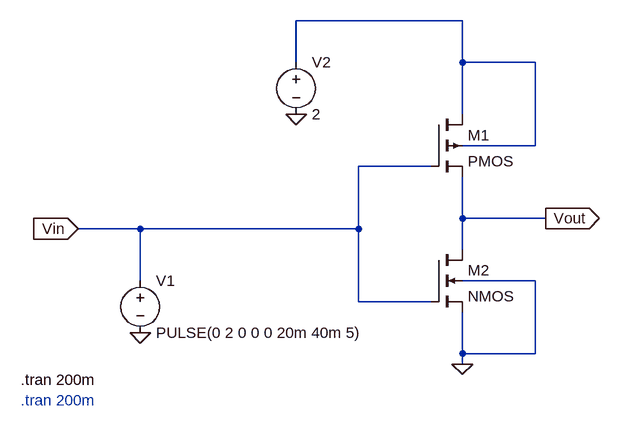
[diagram p0: schematic CMOS inverter transient.asc]
CMOS inverter transient.asc, the LTspice schematic file:
Version 4.1
SHEET 1 880 680
WIRE 544 -208 288 -208
WIRE 288 -144 288 -208
WIRE 544 -144 544 -208
WIRE 656 -144 544 -144
WIRE 544 -64 544 -144
WIRE 656 -16 656 -144
WIRE 656 -16 544 -16
WIRE 496 16 384 16
WIRE 544 96 544 32
WIRE 672 96 544 96
WIRE 48 112 -48 112
WIRE 384 112 384 16
WIRE 384 112 48 112
WIRE 544 144 544 96
WIRE 48 192 48 112
WIRE 656 192 544 192
WIRE 384 224 384 112
WIRE 496 224 384 224
WIRE 544 304 544 240
WIRE 656 304 656 192
WIRE 656 304 544 304
WIRE 544 320 544 304
FLAG -48 112 Vin
IOPIN -48 112 In
FLAG 48 272 0
FLAG 288 -64 0
FLAG 544 320 0
FLAG 672 96 Vout
IOPIN 672 96 Out
SYMBOL voltage 48 176 R0
WINDOW 123 0 0 Left 0
WINDOW 39 0 0 Left 0
SYMATTR InstName V1
SYMATTR Value PULSE(0 2 0 0 0 20m 40m 5)
SYMBOL voltage 288 -160 R0
WINDOW 123 0 0 Left 0
WINDOW 39 0 0 Left 0
SYMATTR InstName V2
SYMATTR Value 2
SYMBOL pmos4 496 -64 R0
SYMATTR InstName M1
SYMBOL nmos4 496 144 R0
SYMATTR InstName M2
TEXT -136 344 Left 2 !.tran 200m
TEXT -136 376 Left 2 ;.tran 200m

The netlist it stands for:
* CMOS inverter transient.asc
V1 Vin 0 PULSE(0 2 0 0 0 20m 40m 5)
V2 N001 0 2
M1 N001 Vin Vout N001 PMOS
M2 Vout Vin 0 0 NMOS
.model NMOS NMOS
.model PMOS PMOS
.lib standard.mos
.tran 200m
* .tran 200m
.backanno
.end